# EAGLE schematic dualsmartplug (EAGLE 6.6.0)
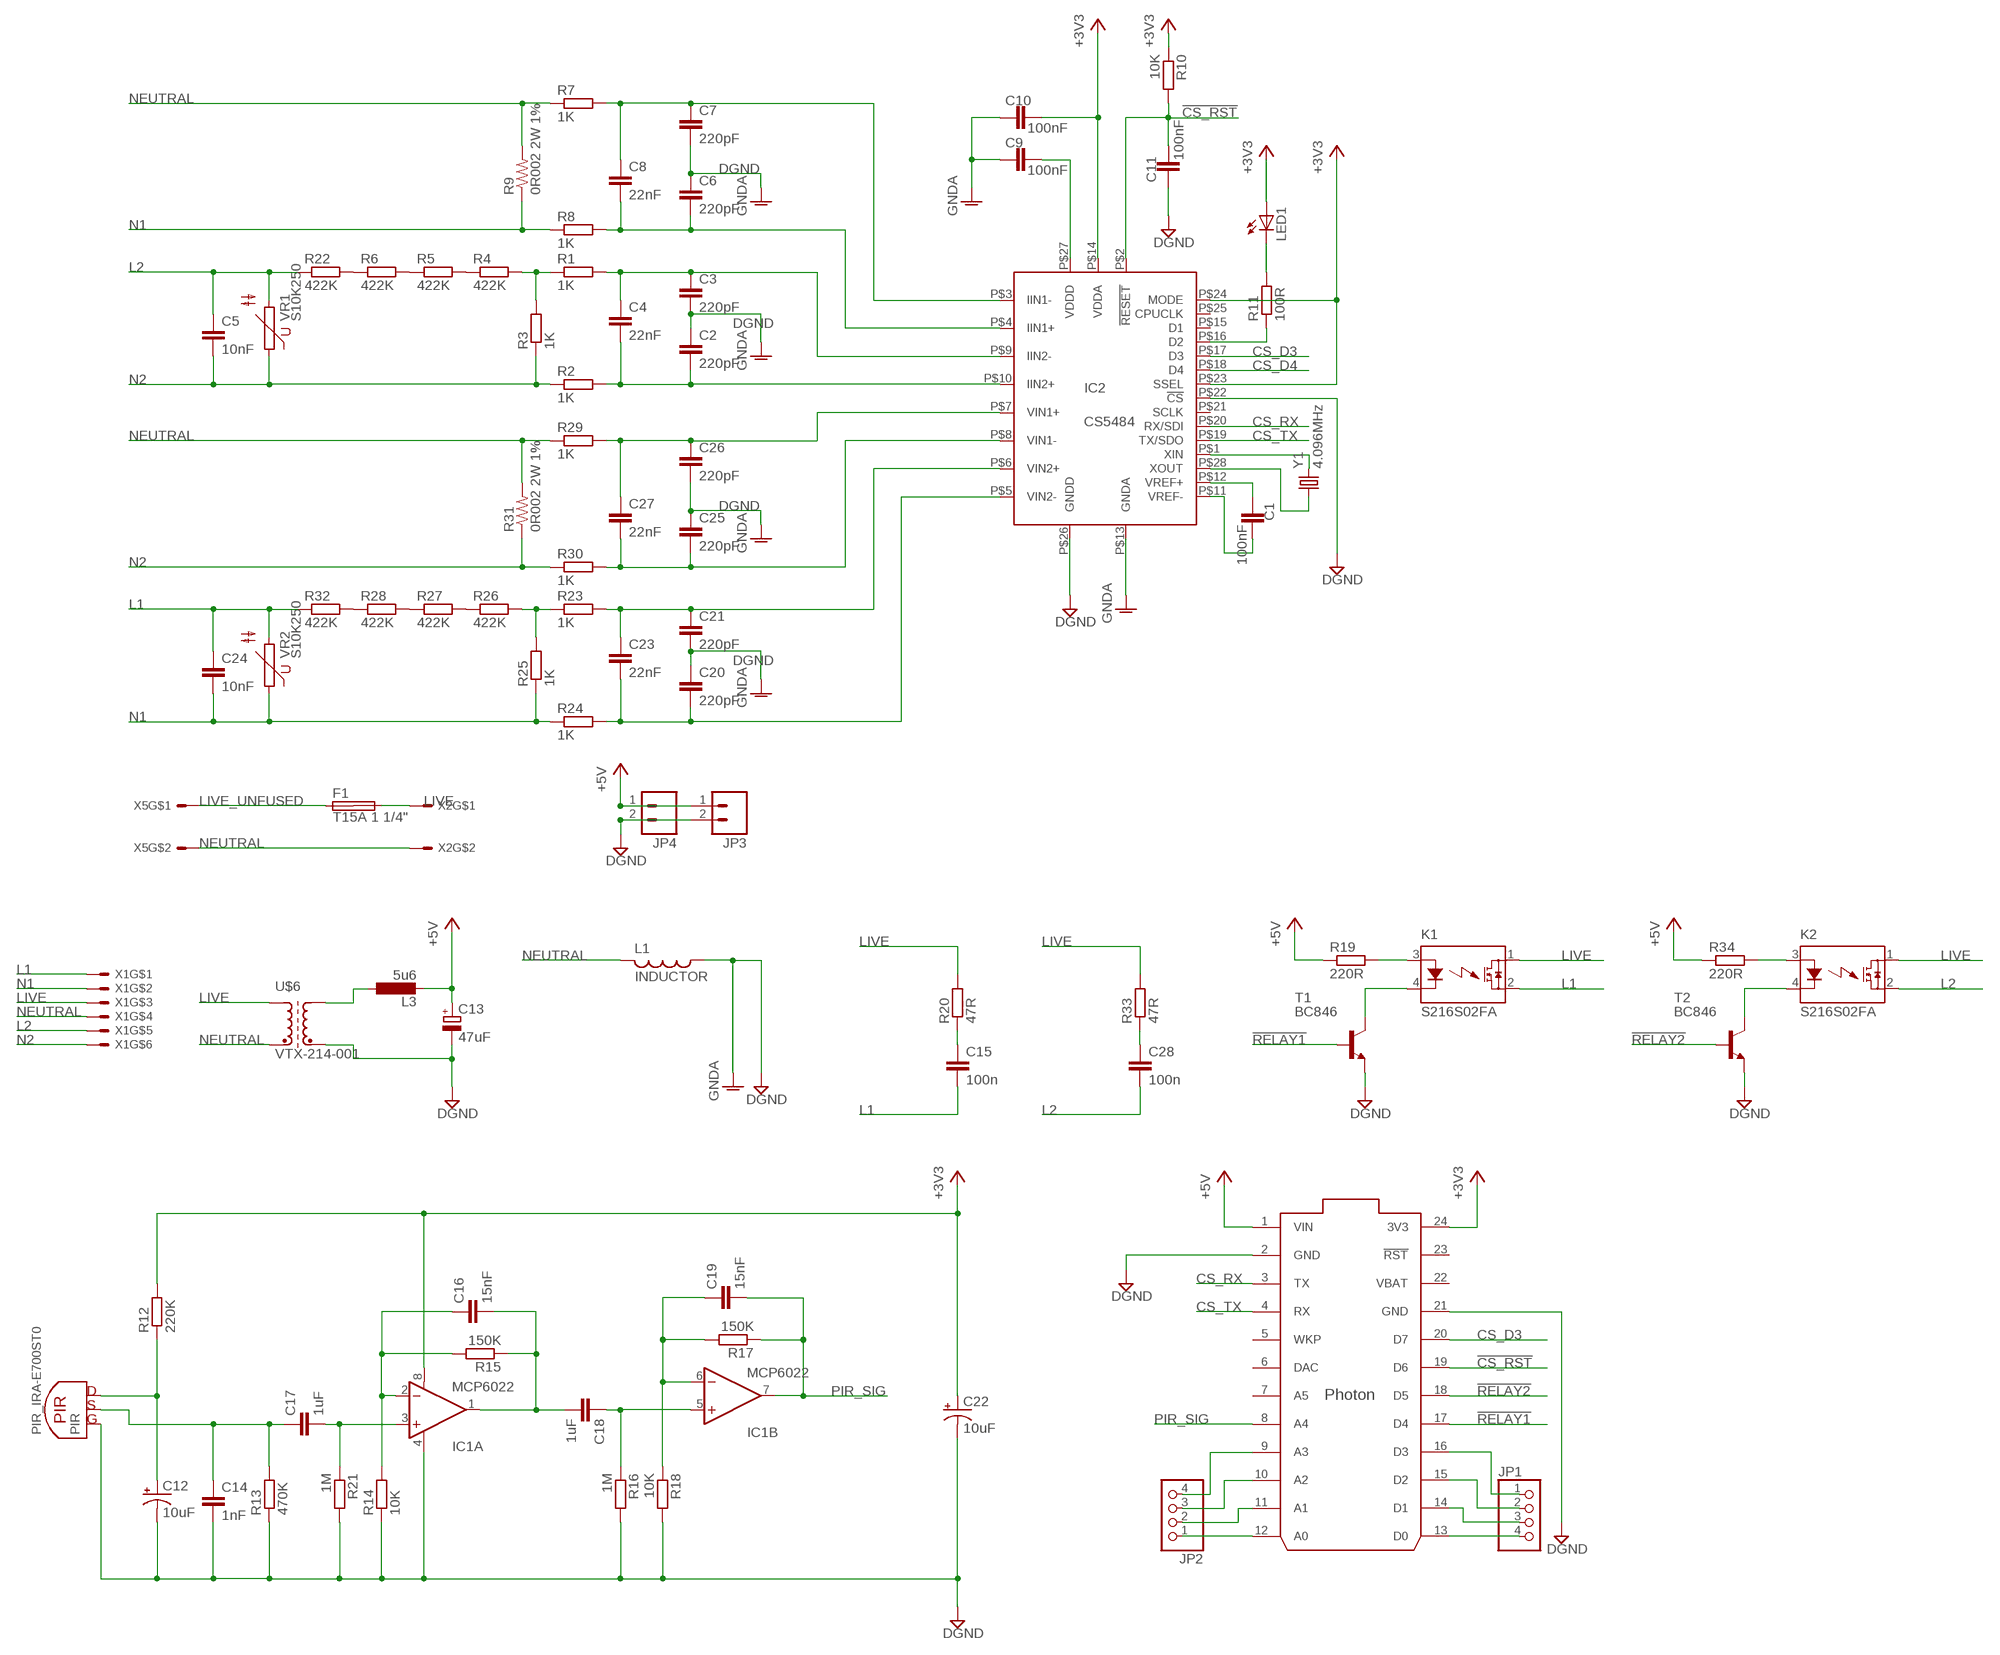
[diagram p0: schematic, sheet 1]

## Parts
C1  100nF  CAP0603-CAP  [0603-CAP]
C2  220pF  CAP0603-CAP  [0603-CAP]
C3  220pF  CAP0603-CAP  [0603-CAP]
C4  22nF  CAP0603-CAP  [0603-CAP]
C5  10nF  CAP0603-CAP  [0603-CAP]
C6  220pF  CAP0603-CAP  [0603-CAP]
C7  220pF  CAP0603-CAP  [0603-CAP]
C8  22nF  CAP0603-CAP  [0603-CAP]
C9  100nF  CAP0603-CAP  [0603-CAP]
C10  100nF  CAP0603-CAP  [0603-CAP]
C11  100nF  CAP0603-CAP  [0603-CAP]
C12  10uF  CAP_POL1206  [EIA3216]
C13  47uF  CPOL-EU153CLV-0505  [153CLV-0505]
C14  1nF  CAP0603-CAP  [0603-CAP]
C15  100n  C-EU150-054X183  [C150-054X183]
C16  15nF  CAP0603-CAP  [0603-CAP]
C17  1uF  CAP0603-CAP  [0603-CAP]
C18  1uF  CAP0603-CAP  [0603-CAP]
C19  15nF  CAP0603-CAP  [0603-CAP]
C20  220pF  CAP0603-CAP  [0603-CAP]
C21  220pF  CAP0603-CAP  [0603-CAP]
C22  10uF  CAP_POL1206  [EIA3216]
C23  22nF  CAP0603-CAP  [0603-CAP]
C24  10nF  CAP0603-CAP  [0603-CAP]
C25  220pF  CAP0603-CAP  [0603-CAP]
C26  220pF  CAP0603-CAP  [0603-CAP]
C27  22nF  CAP0603-CAP  [0603-CAP]
C28  100n  C-EU150-054X183  [C150-054X183]
F1  T15A 1 1/4"  SHURTER_0031.8231  [SHURTER]
IC1  MCP6022  OPAMP-DUALU  [SO08]
IC2  CS5484  [QFN28-5X5]
JP1  PINHD-1X4  [1X04]
JP2  PINHD-1X4  [1X04]
JP3  M02PTH  [1X02]
JP4  M02PTH  [1X02]
K1  S216S02FA  [S216S02F]
K2  S216S02FA  [S216S02F]
L1  INDUCTOR  [0603]
L3  5u6  ELLCTP  [ELLCTP]
LED1  LEDCHIPLED_1206  [CHIPLED_1206]
PIR  PIR_IRA-E700ST0  [PIR_IRA-E700ST0]
R1  1K  R-EU_0603  [0603]
R2  1K  R-EU_0603  [0603]
R3  1K  R-EU_0603  [0603]
R4  422K  R-EU_0603  [0603]
R5  422K  R-EU_0603  [0603]
R6  422K  R-EU_0603  [0603]
R7  1K  R-EU_0603  [0603]
R8  1K  R-EU_0603  [0603]
R9  0R002 2W 1%  RESISTOR2512  [R2512]
R10  10K  R-EU_0603  [0603]
R11  100R  R-EU_0603  [0603]
R12  220K  R-EU_0603  [0603]
R13  470K  R-EU_0603  [0603]
R14  10K  R-EU_0603  [0603]
R15  150K  R-EU_0603  [0603]
R16  1M  R-EU_0603  [0603]
R17  150K  R-EU_0603  [0603]
R18  10K  R-EU_0603  [0603]
R19  220R  R-EU_0603  [0603]
R20  47R  R-EU_0617/5V  [0617V]
R21  1M  R-EU_0603  [0603]
R22  422K  R-EU_0603  [0603]
R23  1K  R-EU_0603  [0603]
R24  1K  R-EU_0603  [0603]
R25  1K  R-EU_0603  [0603]
R26  422K  R-EU_0603  [0603]
R27  422K  R-EU_0603  [0603]
R28  422K  R-EU_0603  [0603]
R29  1K  R-EU_0603  [0603]
R30  1K  R-EU_0603  [0603]
R31  0R002 2W 1%  RESISTOR2512  [R2512]
R32  422K  R-EU_0603  [0603]
R33  47R  R-EU_0617/5V  [0617V]
R34  220R  R-EU_0603  [0603]
T1  BC846  [SOT23]
T2  BC846  [SOT23]
U$2  PHOTON_WITH_HEADERS  [PHOTON]
U$6  VTX-214-001  [VTX-214-001]
VR1  S10K250  [S10K250]
VR2  S10K250  [S10K250]
X1  MOLEX-39357-6  [MOLEX-39357-6]
X2  MOLEX-39357-2  [MOLEX-39357]
X5  MOLEX-39357-2  [MOLEX-39357]
Y1  4.096MHz  CRYSTAL10.5X4.8  [CRYSTAL-SMD-10.5X4.8-2PIN]

## Nets
!CS_RST: C11.2 IC2.P$2(!RESET) R10.2 U$2.19(D6)
!RELAY1: T1.1(B) U$2.17(D4)
!RELAY2: T2.1(B) U$2.18(D5)
+3V3: C10.2 C22.A(+) IC1.8(A:V+) IC2.P$14(VDDA) IC2.P$23(SSEL) IC2.P$24(MODE) LED1.A R10.1 R12.2 U$2.24(3V3)
+5V: C13.+ JP3.1 JP4.1 L3.2 R19.1 R34.1 U$2.1(VIN)
CS_D3: IC2.P$17(D3) U$2.20(D7)
CS_D4: IC2.P$18(D4)
CS_RX: IC2.P$20(RX/SDI) U$2.3(TX)
CS_TX: IC2.P$19(TX/SDO) U$2.4(RX)
DGND: C2.1 C3.2 C6.1 C7.2 C9.1 C10.1 C11.1 C12.C(-) C13.- C14.2 C20.1 C21.2 C22.C(-) C25.1 C26.2 IC1.4(A:V-) IC2.P$13(GNDA) IC2.P$22(!CS) IC2.P$26(GNDD) JP3.2 JP4.2 L1.1 PIR.GND R13.1 R14.1 R16.2 R18.2 R21.2 T1.2(E) T2.2(E) U$2.2(GND) U$2.21(GND) U$6.P$V-(E2) ; supply symbol labelled GNDA
L1: C15.2 C24.1 K1.2(DS2) R32.1 VR2.2 X1.P$1
L2: C5.1 C28.2 K2.2(DS2) R22.1 VR1.2 X1.P$5
LIVE: F1.P$7(2A) K1.1(DS1) K2.1(DS1) R20.2 R33.2 U$6.P$L(A1) X1.P$3 X2.P$1
LIVE_UNFUSED: F1.P$5(1A) X5.P$1
N1: C24.2 R8.1 R9.1 R24.1 R25.1 VR2.1 X1.P$2
N2: C5.2 R2.1 R3.1 R30.1 R31.1 VR1.1 X1.P$6
N$1: IC2.P$1(XIN) Y1.P$2
N$2: IC2.P$28(XOUT) Y1.P$1
N$3: C1.1 IC2.P$12(VREF+)
N$4: C1.2 IC2.P$11(VREF-)
N$5: C9.2 IC2.P$27(VDDD)
N$6: C12.A(+) PIR.DRAIN+(DRAIN) R12.1
N$7: C2.2 C4.2 IC2.P$10(IIN2+) R2.2
N$8: C3.1 C4.1 IC2.P$9(IIN2-) R1.2
N$9: C6.2 C8.2 IC2.P$4(IIN1+) R8.2
N$10: C7.1 C8.1 IC2.P$3(IIN1-) R7.2
N$11: R1.1 R3.2 R4.2
N$12: C14.1 C17.1 PIR.SOURCE R13.2
N$13: R4.1 R5.2
N$14: R5.1 R6.2
N$15: C16.1 IC1.2(A:-IN) R14.2 R15.2
N$16: IC2.P$16(D2) R11.1
N$17: K1.4(K) T1.3(C)
N$18: C17.2 IC1.3(A:+IN) R21.1
N$19: LED1.C R11.2
N$20: C18.1 IC1.5(B:+IN) R16.1
N$21: L3.1 U$6.P$V+(A2)
N$22: K1.3(A) R19.2
N$23: C15.1 R20.1
N$24: C19.1 IC1.6(B:-IN) R17.2 R18.1
N$25: C16.2 C18.2 IC1.1(A:OUT) R15.1
N$27: JP2.1 U$2.12(A0)
N$28: JP2.2 U$2.11(A1)
N$29: JP2.3 U$2.10(A2)
N$30: JP2.4 U$2.9(A3)
N$31: JP1.4 U$2.13(D0)
N$32: JP1.3 U$2.14(D1)
N$33: JP1.2 U$2.15(D2)
N$34: JP1.1 U$2.16(D3)
N$35: R6.1 R22.2
N$36: C20.2 C23.2 IC2.P$5(VIN2-) R24.2
N$37: C21.1 C23.1 IC2.P$6(VIN2+) R23.2
N$38: R23.1 R25.2 R26.2
N$39: R26.1 R27.2
N$40: R27.1 R28.2
N$41: C25.2 C27.2 IC2.P$8(VIN1-) R30.2
N$42: C26.1 C27.1 IC2.P$7(VIN1+) R29.2
N$43: C28.1 R33.1
N$44: R28.1 R32.2
N$45: K2.4(K) T2.3(C)
N$46: K2.3(A) R34.2
NEUTRAL: L1.2 R7.1 R9.2 R29.1 R31.2 U$6.P$N(E1) X1.P$4 X2.P$2 X5.P$2
PIR_SIG: C19.2 IC1.7(B:OUT) R17.1 U$2.8(A4)
Unconnected: F1.P$6(1B) F1.P$8(2B) IC2.P$15(D1) IC2.P$21(SCLK) IC2.P$25(CPUCLK) U$2.5(WKP) U$2.6(DAC) U$2.7(A5) U$2.23(!RST)

## Power pins joined to a net without a drawn wire
VBAT: U$2.22(VBAT)

## Library data of the parts
C1-C11 C20 C21 C23-C27 = SparkFun:CAP: Capacitor Standard 0603 ceramic capacitor, and 0.1" leaded capacitor.
C12 C22 = SparkFun:CAP_POL: Capacitor Polarized These are standard SMD and PTH capacitors. Normally 10uF, 47uF, and 100uF in electrolytic and tantalum varieties. Always verify the external diameter of the through hole cap, it varies with capacity, voltage, and manufacturer. The EIA devices should be standard.
C13 = rcl:CPOL-EU: POLARIZED CAPACITOR, European symbol
C14 C16-C19 = smartplug:CAP: Capacitor Standard 0603 ceramic capacitor, and 0.1" leaded capacitor.
C15 C28 = rcl:C-EU: CAPACITOR, European symbol
F1 = smartplug:SHURTER_0031.8231: SCHURTER 0031.8231 Fuse Block, 600 V, 600 V, 16 A, Cartridge Fuse Holder, Kicked Terminal, 1; FARNELL_OC: 1162725; MPN: 0031.8231
IC1 = smartplug:OPAMP-DUAL: Operational Amplifier
IC2 = smartplug:CS5484
JP1 JP2 = pinhead:PINHD-1X4: PIN HEADER
JP3 JP4 = SparkFun:M02: Header 2 Standard 2-pin 0.1" header. Use with straight break away headers (SKU : PRT-00116), right angle break away headers (PRT-00553), swiss pins (PRT-00743), machine pins (PRT-00117), and female headers (PRT-00115). Molex polarized connector foot print use with SKU : PRT-08233 with associated crimp pins and housings.
K1 K2 = smartplug:S216S02F: SSR; FARNELL_OC: 1618480; MANUF_PART#: S216S02F; MOUSER_OC: 852-S216S02F
L1 = Rebel:INDUCTOR
L3 = eva:ELLCTP
LED1 = led:LED: LED OSRAM: - CHIPLED LG R971, LG N971, LY N971, LG Q971, LY Q971, LO R971, LY R971 LH N974, LH R974 LS Q976, LO Q976, LY Q976 LO Q996 - Hyper CHIPLED LW Q18S LB Q993, LB Q99A, LB R99A - SideLED LS A670, LO A670, LY A670, LG A670, LP A670 LB A673, LV A673, LT A673, LW A673 LH A674 LY A675 LS A676, LA A676, LO A676, LY A676, LW A676 LS A679, LY A679, LG A679 - Hyper Micro SIDELED® LS Y876, LA Y876, LO Y876, LY Y876 LT Y87S - SmartLED LW L88C, LW L88S LB L89C, LB L89S, LG L890 LS L89K, LO L89K, LY L89K LS L896, LA L896, LO L896, LY L896 - TOPLED LS T670, LO T670, LY T670, LG T670, LP T670 LSG T670, LSP T670, LSY T670, LOP T670, LYG T670 LG T671, LOG T671, LSG T671 LB T673, LV T673, LT T673, LW T673 LH T674 LS T676, LA T676, LO T676, LY T676, LB T676, LH T676, LSB T676, LW T676 LB T67C, LV T67C, LT T67C, LS T67K, LO T67K, LY T67K, LW E67C LS E67B, LA E67B, LO E67B, LY E67B, LB E67C, LV E67C, LT E67C LW T67C LS T679, LY T679, LG T679 LS T770, LO T770, LY T770, LG T770, LP T770 LB T773, LV T773, LT T773, LW T773 LH T774 LS E675, LA E675, LY E675, LS T675 LS T776, LA T776, LO T776, LY T776, LB T776 LHGB T686 LT T68C, LB T68C - Hyper Mini TOPLED® LB M676 - Mini TOPLED Santana® LG M470 LS M47K, LO M47K, LY M47K Source: http://www.osram.convergy.de LUXEON: - LUMILED® LXK2-PW12-R00, LXK2-PW12-S00, LXK2-PW14-U00, LXK2-PW14-V00 LXK2-PM12-R00, LXK2-PM12-S00, LXK2-PM14-U00 LXK2-PE12-Q00, LXK2-PE12-R00, LXK2-PE12-S00, LXK2-PE14-T00, LXK2-PE14-U00 LXK2-PB12-K00, LXK2-PB12-L00, LXK2-PB12-M00, LXK2-PB14-N00, LXK2-PB14-P00, LXK2-PB14-Q00 LXK2-PR12-L00, LXK2-PR12-M00, LXK2-PR14-Q00, LXK2-PR14-R00 LXK2-PD12-Q00, LXK2-PD12-R00, LXK2-PD12-S00 LXK2-PH12-R00, LXK2-PH12-S00 LXK2-PL12-P00, LXK2-PL12-Q00, LXK2-PL12-R00 Source: www.luxeon.com KINGBRIGHT: KA-3528ASYC Source: www.kingbright.com
PIR = smartplug:PIR_IRA-E700ST0: PIR - RE200
R1-R8 R10-R19 R21-R30 R32 R34 = Rebel:R-EU_: RESISTOR, European symbol
R9 R31 = SparkFun:RESISTOR: Resistor Basic schematic elements and footprints for 0603, 1206, and PTH resistors.; FARNELL_OC: 2321760; MANUF_PART#: CRF2512-FV-R002ELF
R20 R33 = resistor:R-EU_: RESISTOR, European symbol
T1 T2 = transistor-neu-to92:BC846: NPN TRANSISTOR
U$2 = smartplug:PHOTON
U$6 = Rebel:VTX-214-001
VR1 VR2 = varistor:S10K250: VARISTOR; FARNELL_OC: 1004355; MANUF_PART#: B72210S0251K101
X1 = Rebel:MOLEX-39357-6
X2 X5 = Rebel:MOLEX-39357-2
Y1 = SparkFun:CRYSTAL: Crystals Various standard crystals. Proven footprints. Spark Fun Electronics SKU : COM-00534; FARNELL_OC: 2467740; MANUF_PART#: ABLS2-4.096MHZ-D4Y-T